# Altium project BatteryBoard.PrjPcb
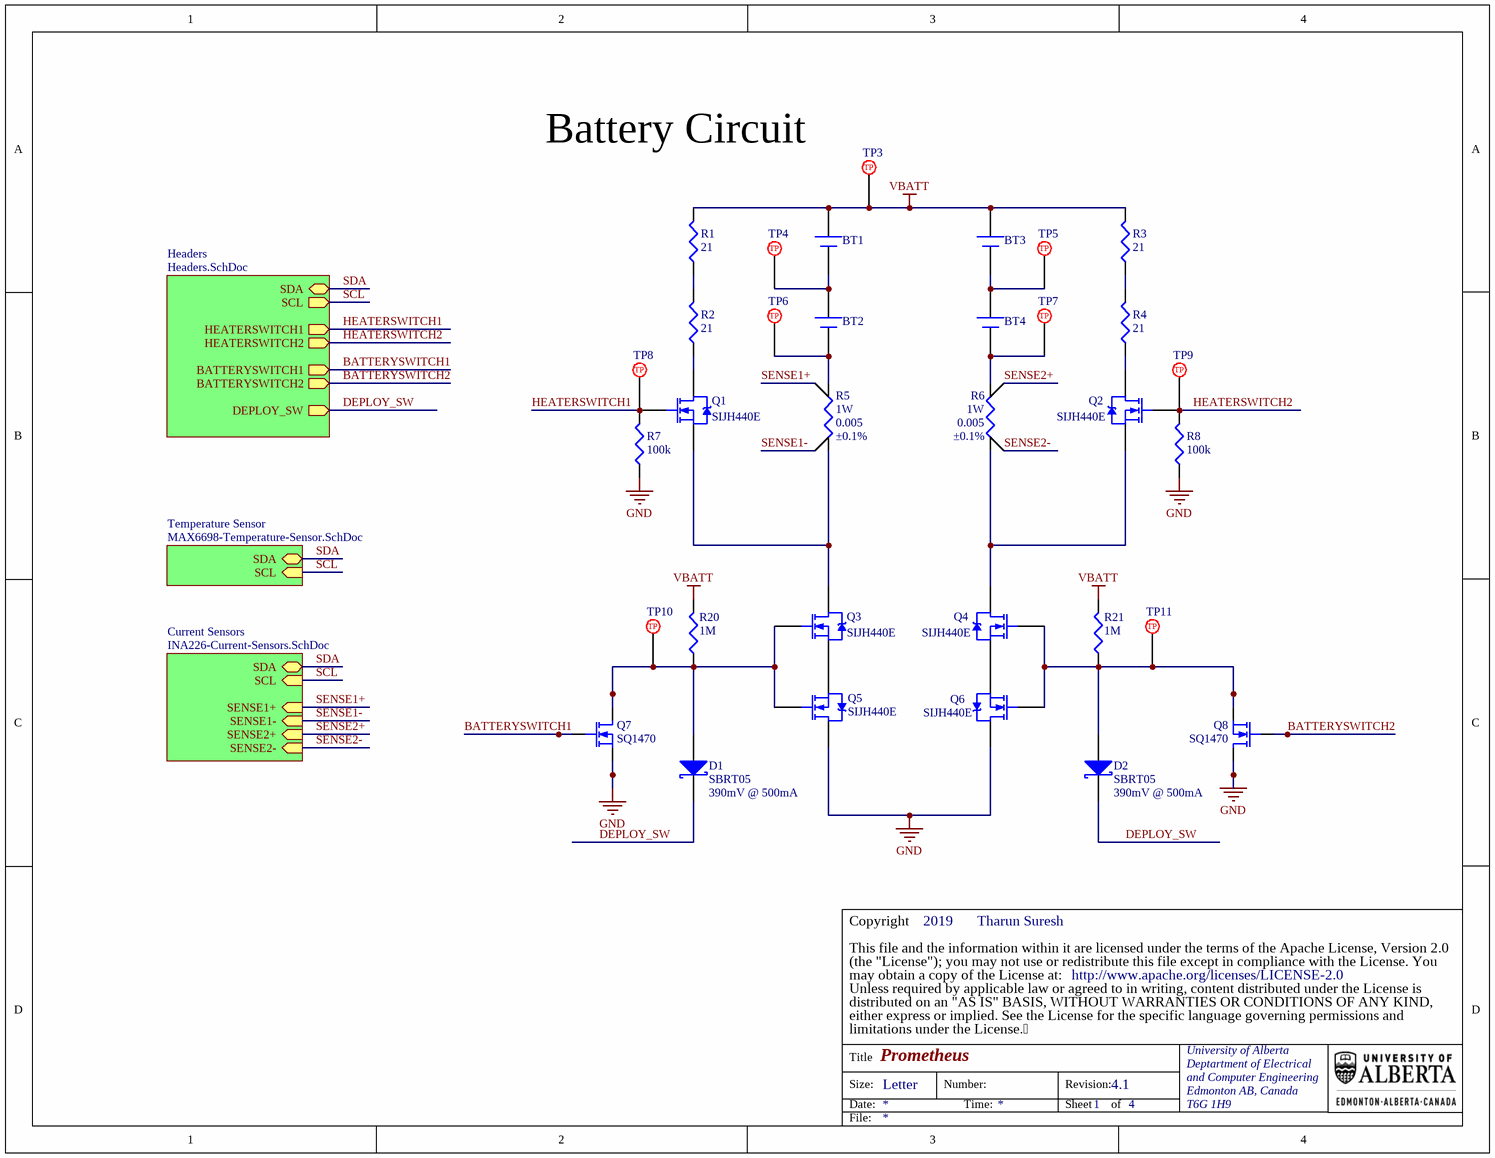
[diagram p0: Prometheus.SchDoc]
4 sheets, 67 parts. Net scope: hierarchical (ports join the sheet entries above them; power ports are global).
Board file: Prometheus.PcbDoc
Sheets:
  Prometheus.SchDoc
    Temperature Sensor = MAX6698-Temperature-Sensor.SchDoc
    Current Sensors = INA226-Current-Sensors.SchDoc
    Headers = Headers.SchDoc

## Sheet Prometheus.SchDoc: Prometheus
size Letter; Author: Tharun Suresh; CompanyName: AlbertaSat; Organization: Altium Limited; Revision: 4.1; SheetNumber: 1; SheetTotal: 4; CopyrightYear: 2019

### Parts
BT1  NCR18650PF  [ORB-PROTECTED18650]  (value not drawn)
BT2  NCR18650PF  [ORB-PROTECTED18650]  (value not drawn)
BT3  NCR18650PF  [ORB-PROTECTED18650]  (value not drawn)
BT4  NCR18650PF  [ORB-PROTECTED18650]  (value not drawn)
D1  SBRT05  Voltage - Forward (Max): 390mV @ 500mA  [DIOD-X2-DFN1006-2]
D2  SBRT05  Voltage - Forward (Max): 390mV @ 500mA  [DIOD-X2-DFN1006-2]
Q1  SIJH440E  [VSH-POWERPAK8X8L]
Q2  SIJH440E  [VSH-POWERPAK8X8L]
Q3  SIJH440E  [VSH-POWERPAK8X8L]
Q4  SIJH440E  [VSH-POWERPAK8X8L]
Q5  SIJH440E  [VSH-POWERPAK8X8L]
Q6  SIJH440E  [VSH-POWERPAK8X8L]
Q7  SQ1470  [VSH-SQ1470AEH]
Q8  SQ1470  [VSH-SQ1470AEH]
R1  value 21  [VSH-CPF1]  (hidden comment: Res3)
R2  value 21  [VSH-CPF1]  (hidden comment: Res3)
R3  value 21  [VSH-CPF1]  (hidden comment: Res3)
R4  value 21  [VSH-CPF1]  (hidden comment: Res3)
R5  value 0.005  Power - Rated: 1W  Tolerance: ±0.1%  [VSH-2512R4B]  (hidden comment: Res Sense)
R6  value 0.005  Power - Rated: 1W  Tolerance: ±0.1%  [VSH-2512R4B]  (hidden comment: Res Sense)
R7  value 100k  [PANA-ERJ6EN]  (hidden comment: Res3)
R8  value 100k  [PANA-ERJ6EN]  (hidden comment: Res3)
R20  value 1M  [PANA-ERJ6EN]  (hidden comment: Res3)
R21  value 1M  [PANA-ERJ6EN]  (hidden comment: Res3)
TP3  5017  [KS-5017]  (value not drawn)
TP4  5017  [KS-5017]  (value not drawn)
TP5  5017  [KS-5017]  (value not drawn)
TP6  5017  [KS-5017]  (value not drawn)
TP7  5017  [KS-5017]  (value not drawn)
TP8  5017  [KS-5017]  (value not drawn)
TP9  5017  [KS-5017]  (value not drawn)
TP10  5017  [KS-5017]  (value not drawn)
TP11  5017  [KS-5017]  (value not drawn)

### Sub-sheets
Current Sensors = INA226-Current-Sensors.SchDoc: SCL (in), SDA (bidir), SENSE2+ (in), SENSE2- (in), SENSE1- (in), SENSE1+ (in)
Headers = Headers.SchDoc: SCL (out), SDA (bidir), HEATERSWITCH1 (out), HEATERSWITCH2 (out), BATTERYSWITCH1 (out), BATTERYSWITCH2 (out), DEPLOY_SW (out)
Temperature Sensor = MAX6698-Temperature-Sensor.SchDoc: SDA (bidir), SCL (in)

### Nets
GND: Q5.2(D) Q6.2(D) Q7.3(S) Q8.1(D) R7.1 R8.1
VBATT: BT1.1(+) BT3.1(+) R1.2 R3.2 R20.2 R21.2 TP3.1
BATTERYSWITCH1: Q7.2(G) ; sheet Headers/BATTERYSWITCH1
BATTERYSWITCH2: Q8.2(G) ; sheet Headers/BATTERYSWITCH2
DEPLOY_SW: D1.2(K) D2.2(K) ; sheet Headers/DEPLOY_SW
HEATERSWITCH1: Q1.1(G) R7.2 TP8.1 ; sheet Headers/HEATERSWITCH1
HEATERSWITCH2: Q2.1(G) R8.2 TP9.1 ; sheet Headers/HEATERSWITCH2
SCL: sheet Temperature Sensor/SCL, sheet Current Sensors/SCL, sheet Headers/SCL
SDA: sheet Temperature Sensor/SDA, sheet Current Sensors/SDA, sheet Headers/SDA
SENSE1+: R5.3(S2) ; sheet Current Sensors/SENSE1+
SENSE1-: R5.4(S1) ; sheet Current Sensors/SENSE1-
SENSE2+: R6.4(S1) ; sheet Current Sensors/SENSE2+
SENSE2-: R6.3(S2) ; sheet Current Sensors/SENSE2-
NetBT1_2: BT1.2(-) BT2.1(+) TP4.1
NetBT2_2: BT2.2(-) R5.2(I2) TP6.1
NetBT3_2: BT3.2(-) BT4.1(+) TP5.1
NetBT4_2: BT4.2(-) R6.1(I1) TP7.1
NetD1_1: D1.1(A) Q3.1(G) Q5.1(G) Q7.1(D) R20.1 TP10.1
NetD2_1: D2.1(A) Q4.1(G) Q6.1(G) Q8.3(S) R21.1 TP11.1
NetQ1_2: Q1.2(D) R2.1
NetQ1_3: Q1.3(S) Q3.2(D) R5.1(I1)
NetQ2_2: Q2.2(D) R4.1
NetQ2_3: Q2.3(S) Q4.2(D) R6.2(I2)
NetQ3_3: Q3.3(S) Q5.3(S)
NetQ4_3: Q4.3(S) Q6.3(S)
NetR1_1: R1.1 R2.2
NetR3_1: R3.1 R4.2

### Notes on the sheet
- (near TP3) Battery Circuit
- (the "License"); you may not use or redistribute this file except in compliance with the License. You
- This file and the information within it are licensed under the terms of the Apache License, Version 2.0
- Copyright
- Unless required by applicable law or agreed to in writing, content distributed under the License is
- distributed on an "AS IS" BASIS, WITHOUT WARRANTIES OR CONDITIONS OF ANY KIND,
- either express or implied. See the License for the specific language governing permissions and
- limitations under the License.
- may obtain a copy of the License at:
- http://www.apache.org/licenses/LICENSE-2.0
- Title
- Size:
- Date:
- Letter
- Number:
- Time:
- Revision:
- Sheet
- of
- University of Alberta
- Deptartment of Electrical
- and Computer Engineering
- Edmonton AB, Canada
- T6G 1H9
- File:
- (in symbol PTP-KS-00001) TP

### Library data of the parts
BT1-BT4 = PBT-ORB-00001: 18650 Battery-Panasonic Protected 2900mAh NCR18650PF Li-ion inside-10 Amp Dual Protection; Index: 1; Designator: BT?; Battery Cell Size: 18650 Protected; Capacity: 2.9Ah; Voltage - Rated: 3.6V; Part Number: PBT-ORB-00001; Manufacturer Part Number: BRB-2900; Supplier Part Number 1: BRB-2900; Supplier 1: Orbtronic; Publisher: AlbertaSat; Published: 5/24/2019; LatestRevisionDate: 5/24/2019; LatestRevisionNote: ...; Supplier Link: #https://www.orbtronic.com/batteries-chargers/protected-panasonic-18650-li-ion-battery-cell-ncr18650-protection-made-in-japan-top-button#
D1 D2 = 29: SUPER BARRIER RECTIFIER X2-DFN10; Part Number: 29; Manufacturer Part Number: SBRT05U20LPS-7B; Designator: D?; Published: 8-Jun-2000; LatestRevisionDate: 17-Jul-2002; LatestRevisionNote: Re-released for DXP Platform.; PackageReference: DFN 0402 (1006 Metric); Publisher: Altium Limited; PackageDescription: DO-214-AA/SMB; 2 C-Bend Leads; Body 5.3 x 3.6 mm, inc. leads (LxW); Code_JEDEC: DO-214-AA; Supplier Part Number 1: SBRT05U20LPS-7BDICT-ND; Supplier 1: Digi-Key; Supplier Part Number 2: 621-SBRT05U20LPS-7B; Supplier 2: Mouser; Supplier Link: #https://www.digikey.ca/products/en?keywords=SBRT05U20LPS-7BDICT-ND#
Q1-Q6 = PQ-VSH-00270: NMOS-2; Manufacturer Part Number: SIJH440E-T1-GE3; Note: Pin 2 is electrically connected to pin 4.; Index: 270; Designator: Q?; Published: 2019-05-24; LatestRevisionDate: 2019-05-24; LatestRevisionNote: ...; DatasheetVersion: PD-9.814; PackageVersion: Feb-1997; PackageReference: VSH-POWERPAK8X8L; Publisher: AlbertaSat; PackageDescription: TO, Thru-Hole, Vertical, Heatsink Mounted; 3 In-Line Leads; Pitch 2.54 mm; ComponentLink1Description: Manufacturer Link; ComponentLink1URL: http://www.irf.com/; Part Number: PQ-VSH-00270; Supplier Part Number 1: SIJH440E-T1-GE3CT-ND; Supplier 1: Digi-key; Supplier Part Number 2: 78-SIJH440E-T1-GE3; Supplier 2: Mouser; Supplier Link: #https://www.digikey.ca/product-detail/en/vishay-siliconix/SIJH440E-T1-GE3/SIJH440E-T1-GE3CT-ND/6709032#
Q7 Q8 = PQ-VSH-00227: MOSFET N-CH 30V 2.8A SC70; Manufacturer Part Number: SQ1470AEH-T1_GE3; Index: 227; Designator: Q?; Published: 7/12/2017; LatestRevisionDate: 7/12/2017; LatestRevisionNote: ...; PackageVersion: 1995/1996; PackageReference: VSH-SOT363; Publisher: AlbertaSat; PackageDescription: SOT23, 6-Leads, Body 2.00x2.10mm, Pitch 0.65mm, IPC Low Density; Part Number: PQ-VSH-00227; Supplier Part Number 1: SQ1470AEH-T1_GE3CT-ND; Supplier 1: Digi-key; Supplier Part Number 2: 78-SQ1470AEH-T1_GE3; Supplier 2: Mouser; Supplier Link: #https://www.digikey.ca/product-detail/en/vishay-siliconix/SQ1470AEH-T1_GE3/SQ1470AEH-T1_GE3CT-ND/6595360#; Applications: Automotive
R1-R4 = PR-VSH-00269: 21 Ohms ±1% 1W Through Hole Resistor Axial Flame Proof, Moisture Resistant, Safety Metal Film; Manufacturer Part Number: CPF121R000FKEE6; Index: 269; Designator: R?; Temperature Coefficient: ±100ppm/°C; Published: 3/27/2019; LatestRevisionDate: 3/27/2019; LatestRevisionNote: ...; PackageReference: VSH-CPF1; Publisher: AlbertaSat; PackageDescription: RESISTOR METAL FILM 1W 21.0 OHM; Part Number: PR-VSH-00269; Supplier Part Number 1: CPF21.0CCT-ND; Supplier 1: Digi-key; Supplier Link: https://www.digikey.ca/products/en/resistors/through-hole-resistors/53?k=cpf1&k=&pkeyword=cpf1&sv=0&pv1989=0&pv2085=u21+Ohms&sf=0&FV=ffe00035&quantity=&ColumnSort=0&page=1&stock=1&pageSize=25; Tolerance: ±1%; Power - Rated: 1W; Applications: Automotive
R5 R6 = PR-VSH-00234: RES SMD 0.005 OHM 0.1% 1W 2512; Manufacturer Part Number: Y14870R00500B9R; Index: 234; Designator: R?; Temperature Coefficient: ±15ppm/°C; Part Number: PR-VSH-00234; Supplier Part Number 1: 804-1043-1-ND; Supplier 1: Digi-key; Supplier Part Number 2: 71-CSM25120R0050BST; Supplier 2: Mouser; Publisher: AlbertaSat; Published: 2017-07-12; LatestRevisionDate: 2017-07-12; LatestRevisionNote: ...; PackageReference: VSH-2512R4B; Supplier Link: http://www.digikey.ca/product-search/en?keywords=804-1043-1-ND; Applications: Automotive
R7 R8 = 18749: RES SMD 100K OHM 1% 1/8W 0805; Part Number: 18749; Manufacturer Part Number: ERJ-6ENF1003V; Designator: R?; Power: 0.125W, 1/8W; Temperature Coefficient: ±100ppm/°C; Published: 8-Jun-2000; LatestRevisionDate: 29-May-2009; LatestRevisionNote: IPC-7351 Footprint Added.; PackageReference: 0805 (2012 Metric); Publisher: Altium Limited; PackageDescription: Chip Resistor, 2-Leads, Body 2.00x1.25mm, IPC Low Density; Supplier Part Number 1: P100KCCT-ND; Supplier 1: Digi-Key; Supplier Link: http://www.digikey.ca/product-search/en?keywords=P100KCCT-ND; Tolerance: ±1%
R20 R21 = 19707: RES SMD 1M OHM 1% 1/8W 0805; Part Number: 19707; Manufacturer Part Number: ERJ-6ENF1004V; Power: 0.125W, 1/8W; Temperature Coefficient: ±100ppm/°C; Published: 8-Jun-2000; LatestRevisionDate: 29-May-2009; LatestRevisionNote: IPC-7351 Footprint Added.; PackageReference: 0805 (2012 Metric); Publisher: Altium Limited; PackageDescription: Chip Resistor, 2-Leads, Body 2.00x1.25mm, IPC Low Density; Supplier Part Number 1: P1.00MCCT-ND; Supplier 1: Digi-Key; Supplier Link: http://www.digikey.ca/product-search/en?keywords=P1.00MCCT-ND; Tolerance: ±1%
TP3-TP11 = PTP-KS-00001: PC TEST POINT MINI SMD; Index: 1; Supplier 1: Digi-key; Supplier 2: Newark; Supplier 3: Mouser; Part Number: PTP-KS-00001; Manufacturer Part Number: 5017; Supplier Part Number 1: 36-5017CT-ND; Publisher: AlbertaSat; Published: 3/15/2016; LatestRevisionDate: 3/15/2016; LatestRevisionNote: ...; PackageReference: KS-5017; PackageDescription: Testpoint Lug Mini SMD 27X10X152; Supplier Link: http://www.digikey.ca/product-detail/en/keystone-electronics/5017/36-5017TR-ND/2217304

## Sheet MAX6698-Temperature-Sensor.SchDoc: MAX6698 Temperature Sensor
size Letter; Author: Tharun Suresh; CompanyName: AlbertaSat; Organization: Altium Limited; Revision: 4.1; SheetNumber: 3; SheetTotal: 4; CopyrightYear: 2019
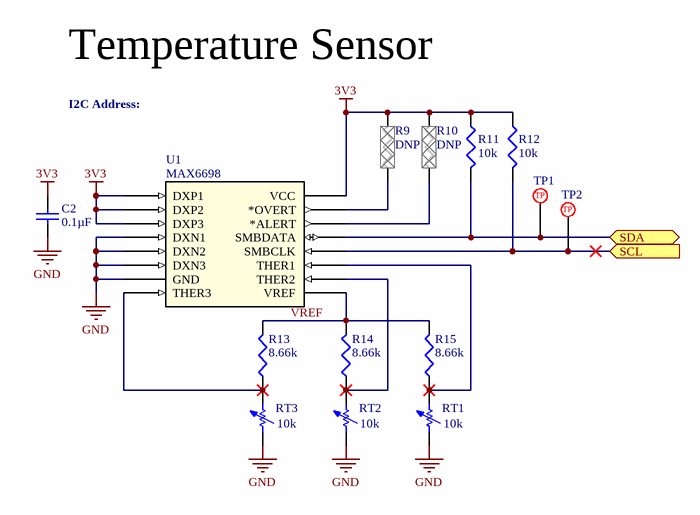
[diagram p1: MAX6698-Temperature-Sensor.SchDoc]

### Parts
C2  value 0.1µF  [TDK-CGA2B]  (hidden comment: Cap)
R9  DNP  [PANA-ERJ2G]  (no BOM)
R10  DNP  [PANA-ERJ2G]  (no BOM)
R11  value 10k  [PANA-ERJ6EN]  (hidden comment: Res3)
R12  value 10k  [PANA-ERJ6EN]  (hidden comment: Res3)
R13  value 8.66k  [PANA-ERA2A]  (hidden comment: Res3)
R14  value 8.66k  [PANA-ERA2A]  (hidden comment: Res3)
R15  value 8.66k  [PANA-ERA2A]  (hidden comment: Res3)
RT1  value 10k  [VSH-1M1002]  (hidden comment: Res Adj1)
RT2  value 10k  [VSH-1M1002]  (hidden comment: Res Adj1)
RT3  value 10k  [VSH-1M1002]  (hidden comment: Res Adj1)
TP1  5017  [KS-5017]  (value not drawn)
TP2  5017  [KS-5017]  (value not drawn)
U1  MAX6698  [MAX-21-0055H-16]

### Ports
SCL (in), SDA (bidir)

### Nets
3V3: C2.2 R9.2 R10.2 R11.1 R12.1 U1.1(DXP1) U1.3(DXP2) U1.5(DXP3) U1.12(VCC)
GND: C2.1 RT1.1 RT2.1 RT3.1 U1.2(DXN1) U1.4(DXN2) U1.6(DXN3) U1.16(GND)
SCL: R12.2 TP2.1 U1.15(SMBCLK) ; port SCL
SDA: R11.2 TP1.1 U1.14(SMBDATA) ; port SDA
VREF: R13.2 R14.2 R15.2 U1.8(VREF)
NetR9_1: R9.1 U1.11(*OVERT)
NetR10_1: R10.1 U1.13(*ALERT)
NetR13_1: R13.1 RT3.2 U1.7(THER3)
NetR14_1: R14.1 RT2.2 U1.9(THER2)
NetR15_1: R15.1 RT1.2 U1.10(THER1)

### Notes on the sheet
- Temperature Sensor
- I2C Address:
- (the "License"); you may not use or redistribute this file except in compliance with the License. You
- This file and the information within it are licensed under the terms of the Apache License, Version 2.0
- Copyright
- Unless required by applicable law or agreed to in writing, content distributed under the License is
- distributed on an "AS IS" BASIS, WITHOUT WARRANTIES OR CONDITIONS OF ANY KIND,
- either express or implied. See the License for the specific language governing permissions and
- limitations under the License.
- may obtain a copy of the License at:
- http://www.apache.org/licenses/LICENSE-2.0
- Title
- Size:
- Date:
- Letter
- Number:
- Time:
- Revision:
- Sheet
- of
- University of Alberta
- Deptartment of Electrical
- and Computer Engineering
- Edmonton AB, Canada
- T6G 1H9
- File:
- (in symbol PTP-KS-00001) TP

### Library data of the parts
C2 = PC-TDK-02262: CAP CER 0.1UF 50V X7R 0402; Manufacturer Part Number: CGA2B3X7R1H104M050BB; Index: 2262; Designator: C?; Tolerance: ±20%; Published: 3/16/2016; LatestRevisionDate: 3/16/2016; LatestRevisionNote: ...; PackageReference: 0402 (1005 Metric); Publisher: AlbertaSat; PackageDescription: Radial Cap, Thru-Hole; 2 Leads; 0.3 in Pin Spacing; Part Number: PC-TDK-02262; Supplier Part Number 1: 445-12271-1-ND; Supplier 1: Digi-key; Supplier Link: http://www.digikey.ca/product-search/en?keywords=445-12271-1-ND; Voltage - Rated: 50V; Temperature Coefficient: X7R; Applications: Automotive
R9 R10 = 19766: Part Number: 19766; Designator: R?; Value: DNP; PackageReference: 0402 (1005 Metric); PackageDescription: Chip Resistor, 2-Leads, Body 1.00x0.50mm, IPC Low Density
R11 R12 = 17208: RES SMD 10K OHM 1% 1/8W 0805; Part Number: 17208; Manufacturer Part Number: ERJ-6ENF1002V; Power: 0.125W, 1/8W; Temperature Coefficient: ±100ppm/°C; Published: 8-Jun-2000; LatestRevisionDate: 29-May-2009; LatestRevisionNote: IPC-7351 Footprint Added.; PackageReference: 0805 (2012 Metric); Publisher: Altium Limited; PackageDescription: Chip Resistor, 2-Leads, Body 2.00x1.25mm, IPC Low Density; Supplier Part Number 1: P10.0KCCT-ND; Supplier 1: Digi-Key; Supplier Link: https://www.digikey.com/product-detail/en/panasonic-electronic-components/ERJ-6ENF1002V/P10.0KCCT-ND/119248; Tolerance: ±1%
R13-R15 = 17098: RES SMD 8.66KOHM 0.1% 1/16W 0402; Part Number: 17098; Manufacturer Part Number: ERA-2ARB8661X; Designator: R?; Power: 0.063W, 1/16W; Temperature Coefficient: ±10ppm/°C; Published: 8-Jun-2000; LatestRevisionDate: 29-May-2009; LatestRevisionNote: IPC-7351 Footprint Added.; PackageReference: 0402 (1005 Metric); Publisher: Altium Limited; PackageDescription: Chip Resistor, 2-Leads, Body 1.00x0.50mm, IPC Low Density; Supplier Part Number 1: P18123CT-ND; Supplier 1: Digi-Key; Supplier Link: http://www.digikey.ca/product-search/en?keywords=P18123CT-ND; Tolerance: ±0.1%
RT1-RT3 = PRT-VSH-00266: NTC THERMISTOR 10K OHM 5% BEAD; Manufacturer Part Number: 01M1002JF; Set Position: 0.5; Index: 266; Power - Rated: 75mW; Published: 5/26/2018; LatestRevisionDate: 5/26/2018; LatestRevisionNote: ...; PackageReference: VSH-1M1002; Publisher: AlbertaSat; PackageDescription: NTC THERMISTOR 10K OHM 5% BEAD; Part Number: PRT-VSH-00266; Supplier Part Number 1: 541-1074-ND; Supplier 1: Digi-key; Supplier Part Number 2: 71-1M1002-A3; Supplier 2: Mouser; Supplier Link: https://www.digikey.ca/product-detail/en/vishay-dale/01M1002JF/541-1074-ND/1427053; Tolerance: ±5%
TP1 TP2 = PTP-KS-00001: PC TEST POINT MINI SMD; Index: 1; Supplier 1: Digi-key; Supplier 2: Newark; Supplier 3: Mouser; Part Number: PTP-KS-00001; Manufacturer Part Number: 5017; Supplier Part Number 1: 36-5017CT-ND; Publisher: AlbertaSat; Published: 3/15/2016; LatestRevisionDate: 3/15/2016; LatestRevisionNote: ...; PackageReference: KS-5017; PackageDescription: Testpoint Lug Mini SMD 27X10X152; Supplier Link: http://www.digikey.ca/product-detail/en/keystone-electronics/5017/36-5017TR-ND/2217304
U1 = PU-MAX-00004: SENSOR TEMPERATURE SMBUS 16QSOP; Index: 4; Part Number: PU-MAX-00004; Manufacturer Part Number: MAX6698EE38+T; Supplier Part Number 1: MAX6698EE38+TCT-ND; Supplier 1: Digi-key; Publisher: AlbertaSat; Published: 6/7/2018; LatestRevisionDate: 6/7/2018; LatestRevisionNote: ...; PackageReference: 16-QSOP; PackageDescription: QSOP, 16-Leads,; Supplier Link: https://www.digikey.ca/product-detail/en/maxim-integrated/MAX6698EE38-T/MAX6698EE38-TCT-ND/2776890

## Sheet INA226-Current-Sensors.SchDoc: INA226 Current Sensors
size Letter; Author: Tharun Suresh; CompanyName: AlbertaSat; Organization: Altium Limited; Revision: 4.1; SheetNumber: 4; SheetTotal: 4; CopyrightYear: 2019
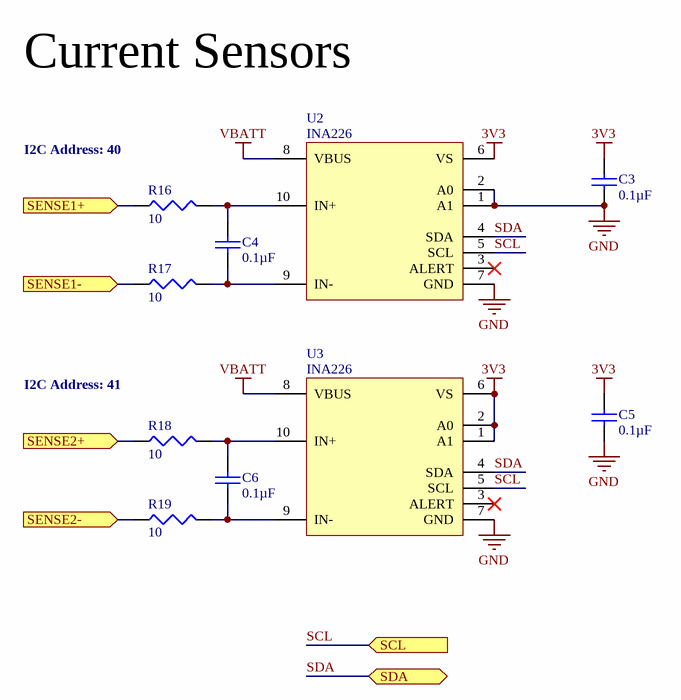
[diagram p2: INA226-Current-Sensors.SchDoc]

### Parts
C3  value 0.1µF  [TDK-CGA2B]  (hidden comment: Cap)
C4  value 0.1µF  [TDK-CGA5L]  (hidden comment: Cap)
C5  value 0.1µF  [TDK-CGA2B]  (hidden comment: Cap)
C6  value 0.1µF  [TDK-CGA5L]  (hidden comment: Cap)
R16  value 10  [PANA-ERA2A]  (hidden comment: Res3)
R17  value 10  [PANA-ERA2A]  (hidden comment: Res3)
R18  value 10  [PANA-ERA2A]  (hidden comment: Res3)
R19  value 10  [PANA-ERA2A]  (hidden comment: Res3)
U2  INA226  [TI-DGS]
U3  INA226  [TI-DGS]

### Ports
SCL (in), SDA (bidir), SENSE1+ (in), SENSE1- (in), SENSE2+ (in), SENSE2- (in)

### Nets
3V3: C3.2 C5.2 U2.6(VS) U3.1(A1) U3.2(A0) U3.6(VS)
GND: C3.1 C5.1 U2.1(A1) U2.2(A0) U2.7(GND) U3.7(GND)
VBATT: U2.8(VBUS) U3.8(VBUS)
SCL: U2.5(SCL) U3.5(SCL) ; port SCL
SDA: U2.4(SDA) U3.4(SDA) ; port SDA
SENSE1+: R16.1 ; port SENSE1+
SENSE1-: R17.1 ; port SENSE1-
SENSE2+: R18.1 ; port SENSE2+
SENSE2-: R19.1 ; port SENSE2-
NetC4_1: C4.1 R17.2 U2.9(IN-)
NetC4_2: C4.2 R16.2 U2.10(IN+)
NetC6_1: C6.1 R19.2 U3.9(IN-)
NetC6_2: C6.2 R18.2 U3.10(IN+)

Not connected (* = marked no-connect by the designer): U2 3(ALERT)*; U3 3(ALERT)*

### Notes on the sheet
- Current Sensors
- (near R16) I2C Address: 40
- (near R18) I2C Address: 41
- (the "License"); you may not use or redistribute this file except in compliance with the License. You
- This file and the information within it are licensed under the terms of the Apache License, Version 2.0
- Copyright
- Unless required by applicable law or agreed to in writing, content distributed under the License is
- distributed on an "AS IS" BASIS, WITHOUT WARRANTIES OR CONDITIONS OF ANY KIND,
- either express or implied. See the License for the specific language governing permissions and
- limitations under the License.
- may obtain a copy of the License at:
- http://www.apache.org/licenses/LICENSE-2.0
- Title
- Size:
- Date:
- Letter
- Number:
- Time:
- Revision:
- Sheet
- of
- University of Alberta
- Deptartment of Electrical
- and Computer Engineering
- Edmonton AB, Canada
- T6G 1H9
- File:

### Library data of the parts
C3 C5 = PC-TDK-02262: as C2 on sheet MAX6698-Temperature-Sensor; Published: 3/16/2016; LatestRevisionDate: 3/16/2016; LatestRevisionNote: ...; PackageReference: 0402 (1005 Metric); Publisher: AlbertaSat; PackageDescription: Radial Cap, Thru-Hole; 2 Leads; 0.3 in Pin Spacing; Part Number: PC-TDK-02262; Supplier Part Number 1: 445-12271-1-ND; Supplier 1: Digi-key; Supplier Link: http://www.digikey.ca/product-search/en?keywords=445-12271-1-ND; Voltage - Rated: 50V; Temperature Coefficient: X7R; Applications: Automotive
C4 C6 = PC-TDK-02295: CAP CER 0.1UF 50V NP0 1206; Manufacturer Part Number: CGA5L2NP01H104J160AA; Index: 2295; Tolerance: ±5%; Published: 3/16/2016; LatestRevisionDate: 3/16/2016; LatestRevisionNote: ...; PackageReference: 1206 (3216 Metric); Publisher: AlbertaSat; PackageDescription: Radial Cap, Thru-Hole; 2 Leads; 0.3 in Pin Spacing; Part Number: PC-TDK-02295; Supplier Part Number 1: 445-12839-1-ND; Supplier 1: Digi-key; Supplier Link: http://www.digikey.ca/product-search/en?keywords=445-12839-1-ND; Voltage - Rated: 50V; Temperature Coefficient: NP0; Applications: Automotive
R16-R19 = 13235: RES SMD 10 OHM 0.5% 1/16W 0402; Part Number: 13235; Manufacturer Part Number: ERA-2AKD100X; Designator: R?; Power: 0.063W, 1/16W; Temperature Coefficient: ±100ppm/°C; Published: 8-Jun-2000; LatestRevisionDate: 29-May-2009; LatestRevisionNote: IPC-7351 Footprint Added.; PackageReference: 0402 (1005 Metric); Publisher: Altium Limited; PackageDescription: Chip Resistor, 2-Leads, Body 1.00x0.50mm, IPC Low Density; Supplier Part Number 1: P10DDCT-ND; Supplier 1: Digi-Key; Supplier Link: http://www.digikey.ca/product-search/en?keywords=P10DDCT-ND; Tolerance: ±0.5%
U2 U3 = 19: IC MONITOR PWR/CURR BIDIR 10MSOP; Part Number: 19; Manufacturer Part Number: INA226AQDGSRQ1; Designator: U?; Supplier Link: https://www.digikey.com/product-detail/en/texas-instruments/INA226AQDGSRQ1/296-42503-1-ND/5416001; PackageReference: TI-MSOP10; Supplier 1: Digi-Key; Supplier Part Number 1: 296-42503-1-ND; Supplier 2: Mouser; Supplier Part Number 2: 595-INA226AQDGSRQ1

## Sheet Headers.SchDoc: Headers
size Letter; Author: Tharun Suresh; CompanyName: AlbertaSat; Organization: Altium Limited; Revision: 4.1; SheetNumber: 2; SheetTotal: 4; CopyrightYear: 2019
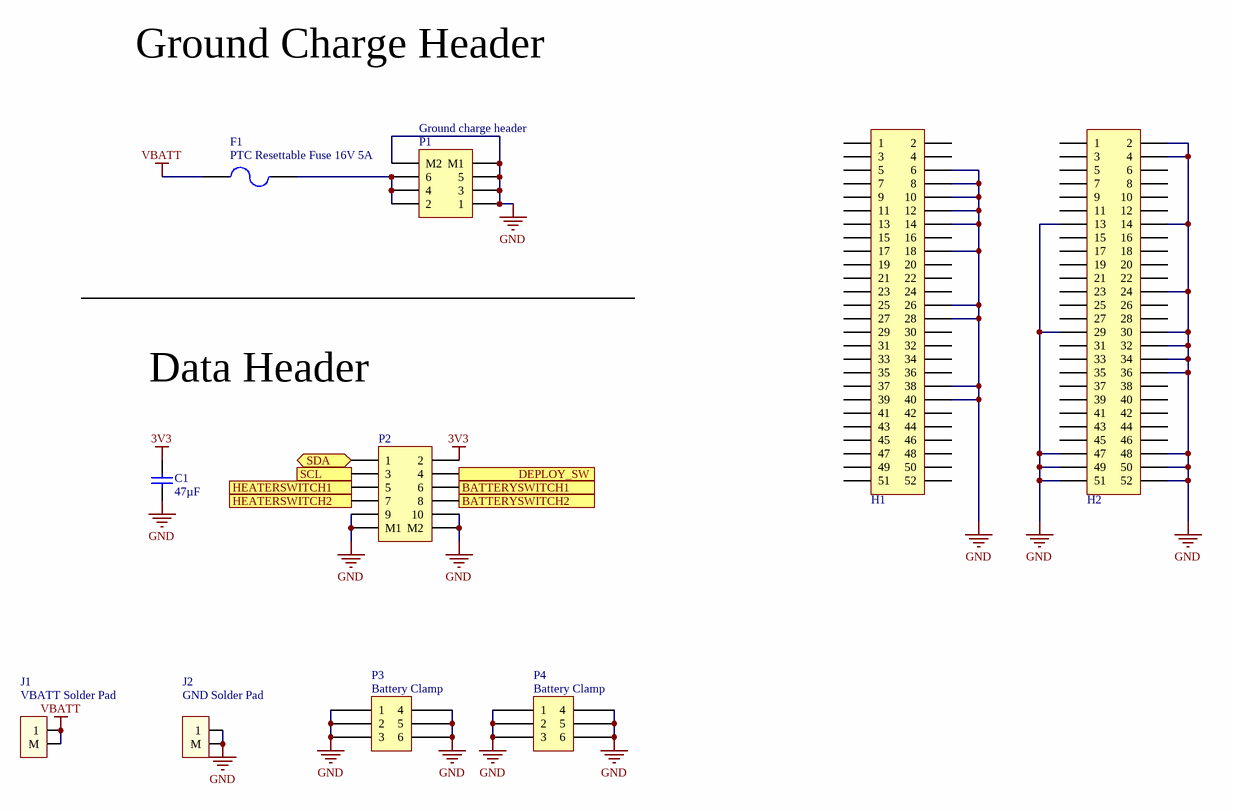
[diagram p3: Headers.SchDoc]

### Parts
C1  value 47µF  [TDK-CGA6P]  (hidden comment: Cap)
F1  PTC Resettable Fuse 16V 5A  [2920L500/16]
H1  SSW-126-23-G-D  [SSW-126-23-G-D]  (value not drawn)
H2  SSW-126-23-G-D  [SSW-126-23-G-D]  (value not drawn)
J1  VBATT Solder Pad  [VBATT-wire-pad]
J2  GND Solder Pad  [GND-WIRE-PAD]
P1  G125-MH10605L1  [HWN-G125-MH10605L1P]  (value not drawn)
P2  G125-MH11005L1  [HWN-G125-MH11005L1P]  (value not drawn)
P3  Battery Clamp  [Battery Clamp]
P4  Battery Clamp  [Battery Clamp]

### Ports
BATTERYSWITCH1 (out), BATTERYSWITCH2 (out), DEPLOY_SW (out), HEATERSWITCH1 (out), HEATERSWITCH2 (out), SCL (out), SDA (bidir)

### Nets
3V3: C1.2 P2.2
GND: C1.1 H1.6 H1.8 H1.10 H1.12 H1.14 H1.18 H1.26 H1.28 H1.38 H1.40 H2.2 H2.4 H2.13 H2.14 H2.24 H2.29 H2.30 H2.32 H2.34 H2.36 H2.47 H2.48 H2.49 H2.50 H2.51 H2.52 J2.1 J2.2(M) P1.1 P1.3 P1.5 P1.7(M1) P1.8(M2) P2.9 P2.10 P2.11(M1) P2.12(M2) P3.1 P3.2 P3.3 P3.4 P3.5 P3.6 P4.1 P4.2 P4.3 P4.4 P4.5 P4.6
VBATT: F1.1 J1.1 J1.2(M)
BATTERYSWITCH1: P2.6 ; port BATTERYSWITCH1
BATTERYSWITCH2: P2.8 ; port BATTERYSWITCH2
DEPLOY_SW: P2.4 ; port DEPLOY_SW
HEATERSWITCH1: P2.5 ; port HEATERSWITCH1
HEATERSWITCH2: P2.7 ; port HEATERSWITCH2
SCL: P2.3 ; port SCL
SDA: P2.1 ; port SDA
NetF1_2: F1.2 P1.2 P1.4 P1.6

Not connected (* = marked no-connect by the designer): H1 1 2 3 4 5 7 9 11 13 15 16 17 19 20 21 22 23 24 25 27 29 30 31 32 33 34 35 36 37 39 41 42 43 44 45 46 47 48 49 50 51 52; H2 1 3 5 6 7 8 9 10 11 12 15 16 17 18 19 20 21 22 23 25 26 27 28 31 33 35 37 38 39 40 41 42 43 44 45 46

### Notes on the sheet
- Ground Charge Header
- (near P1) Ground charge header
- Data Header
- (the "License"); you may not use or redistribute this file except in compliance with the License. You
- This file and the information within it are licensed under the terms of the Apache License, Version 2.0
- Copyright
- Unless required by applicable law or agreed to in writing, content distributed under the License is
- distributed on an "AS IS" BASIS, WITHOUT WARRANTIES OR CONDITIONS OF ANY KIND,
- either express or implied. See the License for the specific language governing permissions and
- limitations under the License.
- may obtain a copy of the License at:
- http://www.apache.org/licenses/LICENSE-2.0
- Title
- Size:
- Date:
- Letter
- Number:
- Time:
- Revision:
- Sheet
- of
- University of Alberta
- Deptartment of Electrical
- and Computer Engineering
- Edmonton AB, Canada
- T6G 1H9
- File:

### Library data of the parts
C1 = PC-TDK-02951: CAP CER 47UF 6.3V X7S 1210; Manufacturer Part Number: CGA6P1X7S0J476M250AC; Index: 2951; Designator: C?; Tolerance: ±20%; Published: 3/16/2016; LatestRevisionDate: 3/16/2016; LatestRevisionNote: ...; PackageReference: 1210 (3225 Metric); Publisher: AlbertaSat; PackageDescription: Radial Cap, Thru-Hole; 2 Leads; 0.3 in Pin Spacing; Part Number: PC-TDK-02951; Supplier Part Number 1: 445-13045-1-ND; Supplier 1: Digi-key; Supplier Link: http://www.digikey.ca/product-search/en?keywords=445-13045-1-ND; Voltage - Rated: 6.3V; Temperature Coefficient: X7S; Applications: Automotive
F1 = PF-LTF-00001: PTC RESET FUSE 16V 5A 2920; Manufacturer Part Number: 2920L500/16MR; Index: 1; Designator: F?; Published: 7/23/2019; LatestRevisionDate: 7/23/2019; LatestRevisionNote: ...; PackageReference: 2920 (7351 Metric), Concave; Publisher: AlbertaSat; PackageDescription: Thru-Hole; 2 Leads; Part Number: PF-LTF-00001; Supplier Part Number 1: F6136CT-ND; Supplier 1: Digi-key; Supplier Link: https://www.digikey.ca/product-detail/en/littelfuse-inc/2920L500-16MR/F6136CT-ND/4147146
H1 H2 = PP-SAM-00002: Index: 3; Designator: P?; Part Number: PP-SAM-00002; Manufacturer Part Number: SSW-126-23-G-D; Supplier Part Number 1: SSW-126-23-G-D; Supplier 1: Samtec; Publisher: AlbertaSat; Published: 6/7/2018; LatestRevisionDate: 6/7/2018; LatestRevisionNote: ...; Supplier Link: #https://www.samtec.com/products/ssw-126-23-g-d#
J1 J2 = Pad I/O
P1 = PP-HWN-00014: CONN HEADER R/A 6POS 1.25MM; Manufacturer Part Number: G125-MH10605L1P; Index: 14; Designator: P?; LatestRevisionDate: 7/8/2019; LatestRevisionNote: ...; Publisher: AlbertaSat; Part Number: PP-HWN-00014; Supplier Part Number 1: 952-2695-ND; Supplier 1: Digi-key; Supplier Part Number 2: 855-G125-MH10605L1P; Supplier 2: Mouser; Published: 7/8/2019; Supplier Link: https://www.digikey.ca/products/en?keywords=952-2695-ND
P2 = PP-HWN-00015: CONN HEADER R/A 10POS 1.25MM; Manufacturer Part Number: G125-MH11005L1P; Index: 15; Designator: P?; LatestRevisionDate: 2019-07-08; LatestRevisionNote: ...; Publisher: AlbertaSat; Part Number: PP-HWN-00015; Published: 2019-07-08; Supplier Link: https://www.digikey.ca/products/en?keywords=952-2696-ND; Supplier 1: Digi-Key; Supplier Part Number 1: 952-2696-ND; Supplier 2: Mouser; Supplier Part Number 2: 855-G125-MH11005L1P

## Nets that join several sheets
3V3: MAX6698-Temperature-Sensor (9 pins), INA226-Current-Sensors (6 pins), Headers (C1.2 P2.2)
GND: Prometheus (6 pins), MAX6698-Temperature-Sensor (8 pins), INA226-Current-Sensors (6 pins), Headers (50 pins)
VBATT: Prometheus (7 pins), INA226-Current-Sensors (U2.8 U3.8), Headers (F1.1 J1.1 J1.2)
BATTERYSWITCH1: Prometheus (Q7.2), Headers (P2.6)
BATTERYSWITCH2: Prometheus (Q8.2), Headers (P2.8)
DEPLOY_SW: Prometheus (D1.2 D2.2), Headers (P2.4)
HEATERSWITCH1: Prometheus (Q1.1 R7.2 TP8.1), Headers (P2.5)
HEATERSWITCH2: Prometheus (Q2.1 R8.2 TP9.1), Headers (P2.7)
SCL: MAX6698-Temperature-Sensor (R12.2 TP2.1 U1.15), INA226-Current-Sensors (U2.5 U3.5), Headers (P2.3)
SDA: MAX6698-Temperature-Sensor (R11.2 TP1.1 U1.14), INA226-Current-Sensors (U2.4 U3.4), Headers (P2.1)
SENSE1+: Prometheus (R5.3), INA226-Current-Sensors (R16.1)
SENSE1-: Prometheus (R5.4), INA226-Current-Sensors (R17.1)
SENSE2+: Prometheus (R6.4), INA226-Current-Sensors (R18.1)
SENSE2-: Prometheus (R6.3), INA226-Current-Sensors (R19.1)